# EAGLE design ToneGeneratorSMD_V2 (EAGLE 9.4.1)
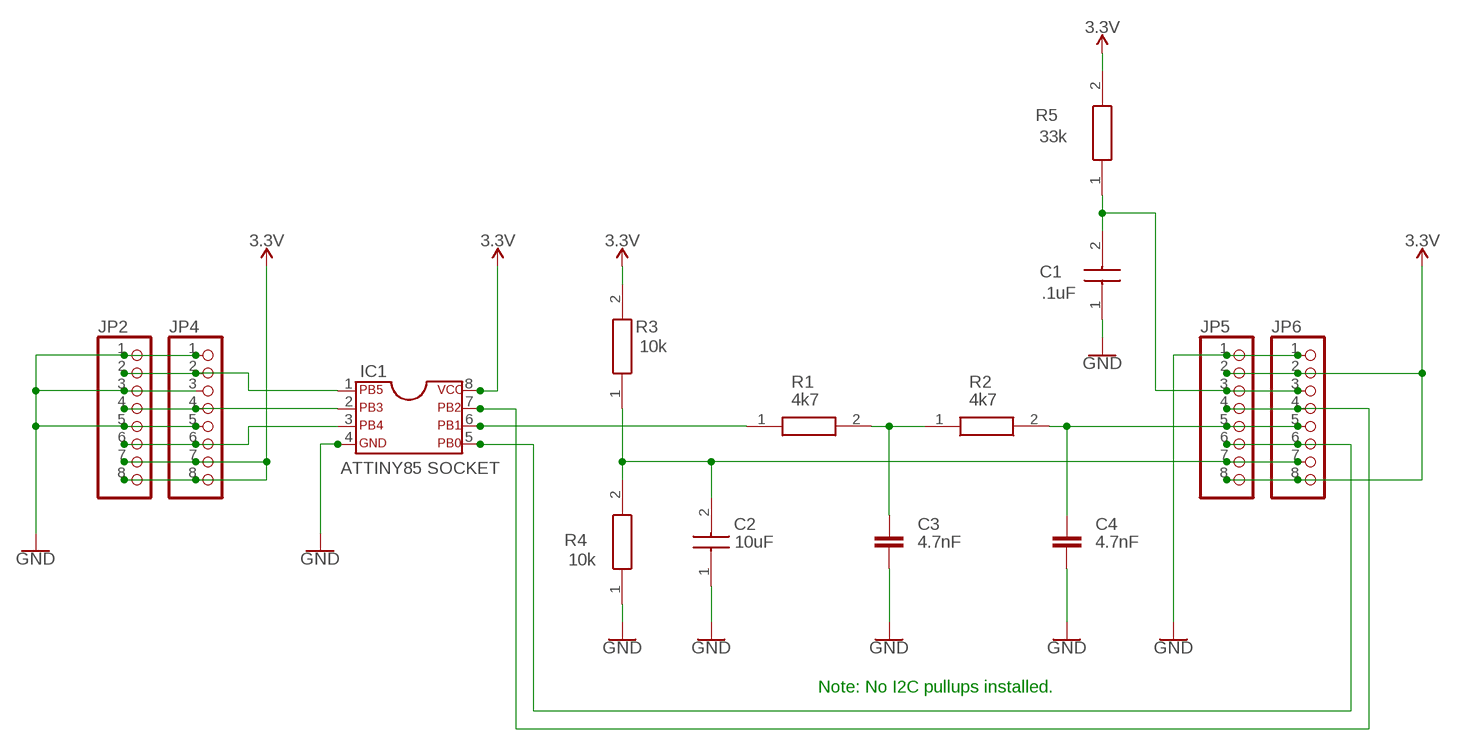
[diagram p0: schematic, sheet 1]

## Parts
C1  .1uF  885012207098  [CAPC2012X90N]
C2  10uF  GRM21BR61E106MA73L  [CAPC2012X145N]
C3  4.7nF  C-EUC0805  [C0805]
C4  4.7nF  C-EUC0805  [C0805]
IC1  ATTINY85 SOCKET  DIL8ATTINY85  [DIL08ATTINY85]
JP2  PINHD-1X8  [1X08]
JP4  PINHD-1X8  [1X08]
JP5  PINHD-1X8  [1X08]
JP6  PINHD-1X8  [1X08]
R1  4k7  ERJ-6GEYJ472V  [RESC2013X65N]
R2  4k7  ERJ-6GEYJ472V  [RESC2013X65N]
R3  10k  ERJ-6GEYJ472V  [RESC2013X65N]
R4  10k  ERJ-6GEYJ472V  [RESC2013X65N]
R5  33k  ERJ-6GEYJ472V  [RESC2013X65N]

## Nets
3.3V: IC1.8 JP2.7 JP2.8 JP4.7 JP4.8 JP5.2 JP5.8 JP6.2 JP6.8 R3.2(R2) R5.2(R2)
GND: C1.1 C2.1 C3.2 C4.2 IC1.4 JP2.1 JP2.3 JP2.5 JP4.1 JP4.3 JP4.5 JP5.1 JP6.1 R4.1(R1)
N$2: C3.1 R1.2(R2) R2.1(R1)
N$3: C4.1 JP5.5 JP6.5 R2.2(R2)
N$5: IC1.6 R1.1(R1)
N$8: IC1.7 JP5.4 JP6.4
N$12: IC1.1 JP2.2 JP4.2
N$14: IC1.2 JP2.4 JP4.4
N$16: IC1.3 JP2.6 JP4.6
N$21: C1.2 JP5.3 JP6.3 R5.1(R1)
N$24: IC1.5 JP5.6 JP6.6
N$25: C2.2 JP5.7 JP6.7 R3.1(R1) R4.2(R2)

## Notes on the sheet
- Note: No I2C pullups installed.

## Library data of the parts
C1 = ToneGenerator_Parts:885012207098: Multilayer Ceramic Capacitors MLCC - SMD/SMT WCAP-CSGP 0.1uF 0805 10% 50V MLCC Source: Datasheet <https://componentsearchengine.com/Datasheets/1/885012207098.pdf>; DESCRIPTION: Multilayer Ceramic Capacitors MLCC - SMD/SMT WCAP-CSGP 0.1uF 0805 10% 50V MLCC; HEIGHT: 0.9mm; MANUFACTURER_NAME: Wurth Elektronik; MANUFACTURER_PART_NUMBER: 885012207098; MOUSER_PART_NUMBER: 710-885012207098; MOUSER_PRICE-STOCK: https://www.mouser.com/Search/Refine.aspx?Keyword=710-885012207098
C2 = ToneGenerator_Parts:GRM21BR61E106MA73L: Multilayer Ceramic Capacitors MLCC - SMD/SMT 0805 10uF 25volts X5R 20% Source: Datasheet <https://componentsearchengine.com/Datasheets/1/GRM21BR61E106MA73L.pdf>; DESCRIPTION: Multilayer Ceramic Capacitors MLCC - SMD/SMT 0805 10uF 25volts X5R 20%; HEIGHT: 1.45mm; MANUFACTURER_NAME: Murata Electronics; MANUFACTURER_PART_NUMBER: GRM21BR61E106MA73L; MOUSER_PART_NUMBER: 81-GRM21BR61E106MA3L; MOUSER_PRICE-STOCK: https://www.mouser.com/Search/Refine.aspx?Keyword=81-GRM21BR61E106MA3L
C3 C4 = rcl:C-EU: CAPACITOR, European symbol; SPICEPREFIX: C
IC1 = ic-package_JGE:DIL8ATTINY85: Dual In Line / Socket
JP2 JP4-JP6 = pinhead:PINHD-1X8: PIN HEADER
R1-R5 = SamacSys_Parts:ERJ-6GEYJ472V: RESISTOR, 0805 4.7K Ohm +/-5% 0.125 W Source: Datasheet <https://componentsearchengine.com/Datasheets/1/ERJ-6GEYJ472V.pdf>; DESCRIPTION: RESISTOR, 0805 4.7K Ohm +/-5% 0.125 W; HEIGHT: mm; MANUFACTURER_NAME: Panasonic; MANUFACTURER_PART_NUMBER: ERJ-6GEYJ472V; MOUSER_PART_NUMBER: 667-ERJ-6GEYJ472V; MOUSER_PRICE-STOCK: https://www.mouser.com/Search/Refine.aspx?Keyword=667-ERJ-6GEYJ472V

## Board
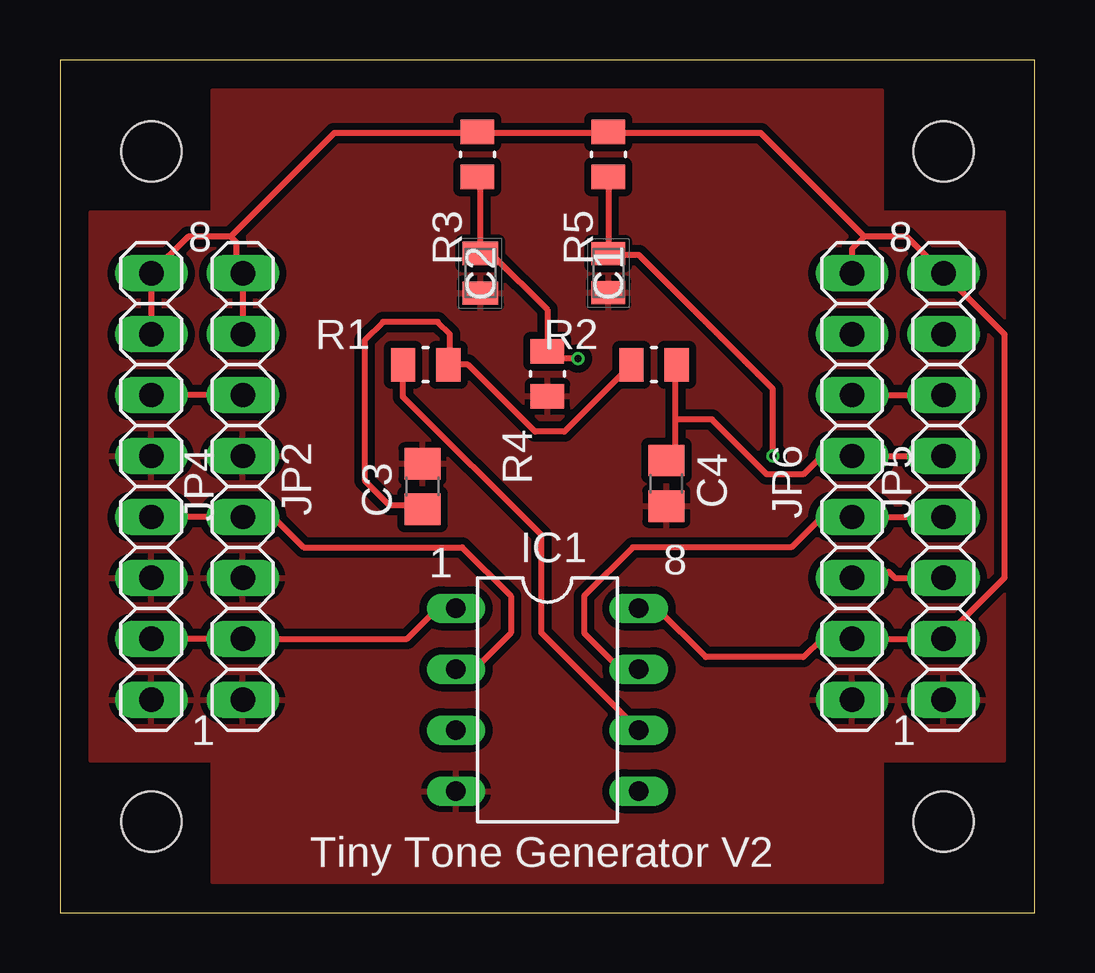
[diagram p1: board, top side]
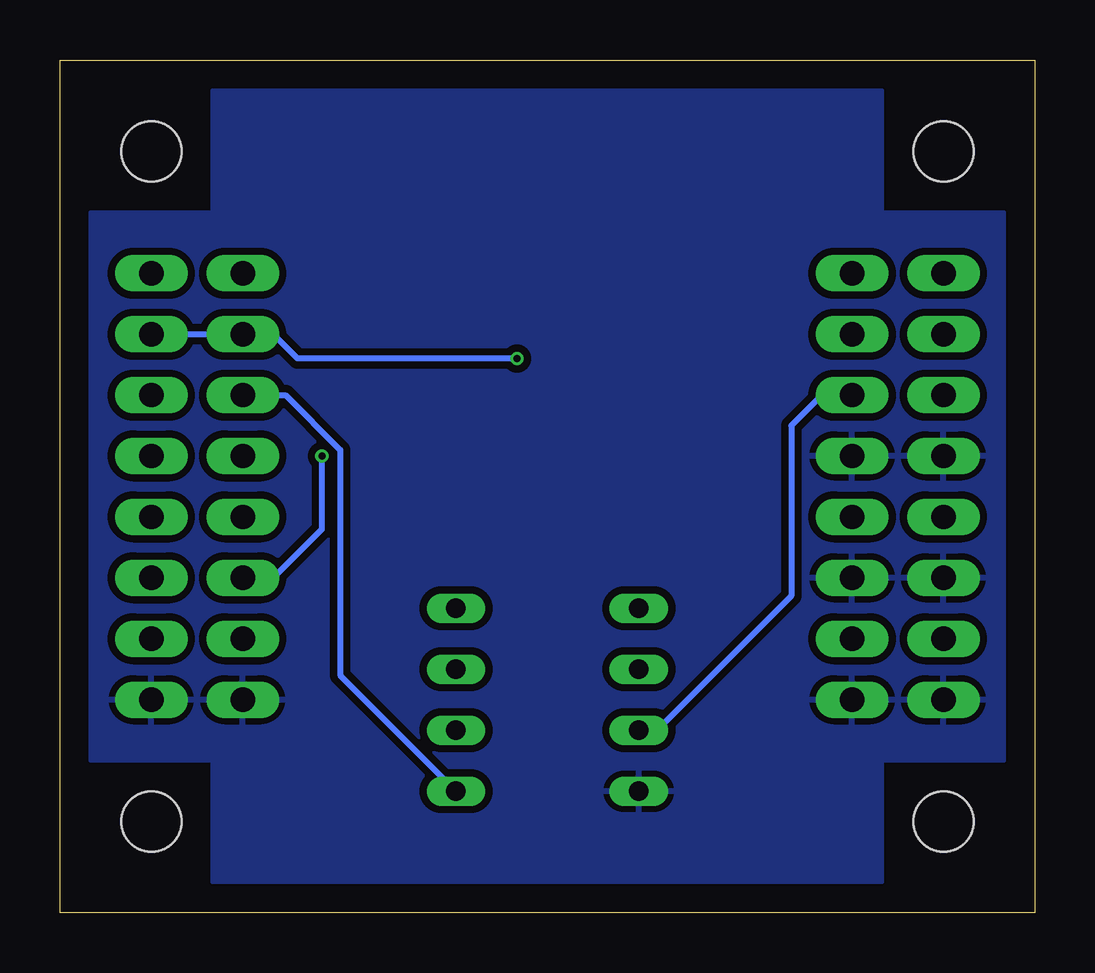
[diagram p2: board, bottom side, seen from below]

Size 40.64 x 35.56 mm. Coordinates in mm from the lower left corner, seen from the top.
Outline: 0,0 40.64,0 40.64,35.56 0,35.56 0,0
Copper layers (1*2*15*16): Top 0.035559375mm / dielectric 0.47751875mm / Route2 0.035559375mm / dielectric 0.47751875mm / Route15 0.035559375mm / dielectric 0.47751875mm / Bottom 0.035559375mm
Design rules "default JGE Seeed V6 10mm Trace": minimum track width 10mil, minimum drill 0.3mm, track to track 10mil, track to pad 10mil, pad to pad 10mil, via to via 10mil, smd to smd 6mil, copper to edge 1mm, drill to drill 4mil, minimum pad ring 5mil, minimum via ring 5mil, stop-mask expansion 4mil, vias tented up to drill 25mil, thermal gap 10mil
Holes 2.5 mm at 3.81,31.75 36.83,31.75 3.81,3.81 36.83,3.81

### Footprints (pad centres in the part's own frame; a part is rotated, then mirrored left to right if it is on the bottom)
CAPC2012X90N = smd 0.96 x 1.39: 1 -0.81,0; 2 0.81,0
CAPC2012X145N = smd 0.97 x 1.47: 1 -0.83,0; 2 0.83,0
C0805 = smd 1.3 x 1.5: 1 -0.95,0; 2 0.95,0
DIL08ATTINY85 = drill 0.813 long: 1 -3.81,-3.81; 2 -1.27,-3.81; 3 1.27,-3.81; 4 3.81,-3.81; 5 3.81,3.81; 6 1.27,3.81; 7 -1.27,3.81; 8 -3.81,3.81
1X08 = drill 1.016 long: 1 -8.89,0; 2 -6.35,0; 3 -3.81,0; 4 -1.27,0; 5 1.27,0; 6 3.81,0; 7 6.35,0; 8 8.89,0
RESC2013X65N = smd 1.016 x 1.397: 1 -0.94,0; 2 0.94,0

### Placement (x,y rotation side)
C1  22.86,26.67 90 top
C2  17.53,26.67 90 top
C3  15.11,17.78 90 top
C4  25.27,17.91 270 top
IC1  20.32,8.89 270 top
JP2  7.62,17.78 90 top
JP4  3.81,17.78 90 top
JP5  36.83,17.78 90 top
JP6  33.02,17.78 90 top
R1  15.24,22.86 0 top
R2  24.77,22.86 0 top
R3  17.4,31.62 90 top
R4  20.32,22.48 90 top
R5  22.86,31.62 90 top

### Tracks (layer width: path | path; a pad name or v marks a point on that pad's centre or on a via)
3.3V
  Top 0.254: IC1.8 24.89,12.7 26.92,10.67 30.99,10.67 31.75,11.43 JP6.2 JP5.2 39.37,13.97 39.37,24.13 JP5.8 35.31,28.19 33.53,28.19 | JP4.7 JP4.8 5.33,28.19 7.11,28.19 | JP2.7 JP2.8 7.37,26.92 7.37,27.94 7.11,28.19 | 22.86,32.51 17.53,32.51 R3.2 17.27,32.51 11.43,32.51 7.11,28.19 | JP6.8 33.02,27.69 33.53,28.19 | 22.86,32.51 29.21,32.51 33.53,28.19 | 22.86,32.51 R5.2
GND
  pour Top (isolate 0.305): 1.27,6.35 6.35,6.35 6.35,1.27 34.29,1.27 34.29,6.35 39.37,6.35 39.37,29.21 34.29,29.21 34.29,34.29 6.35,34.29 6.35,29.21 1.27,29.21
  pour Bottom (isolate 0.305): 1.27,29.21 6.35,29.21 6.35,34.29 34.29,34.29 34.29,29.21 39.37,29.21 39.37,6.35 34.29,6.35 34.29,1.27 6.35,1.27 6.35,6.35 1.27,6.35
N$2
  Top 0.254: 16.26,22.86 17.02,22.86 19.81,20.07 21.03,20.07 R2.1 | 16.26,22.86 16.26,24.13 15.75,24.64 13.46,24.64 12.7,23.88 12.7,18.03 13.72,17.02 14.99,17.02 C3.1 | 16.26,22.86 R1.2
N$3
  Top 0.254: 25.65,20.57 25.65,19.3 25.4,19.05 C4.1 | 25.65,20.57 25.65,22.86 R2.2 | 25.65,20.57 27.18,20.57 29.46,18.29 30.99,18.29 31.75,19.05 JP6.5 JP5.5
N$5
  Top 0.254: IC1.6 20.07,11.68 20.07,15.75 14.3,21.51 R1.1
N$8
  Top 0.254: IC1.7 23.37,10.16 21.84,11.68 21.84,13.21 23.88,15.24 30.48,15.24 31.75,16.51 JP6.4 JP5.4
N$12
  Top 0.254: IC1.1 15.75,12.7 14.48,11.43 JP2.2 JP4.2
N$14
  Top 0.254: IC1.2 17.27,10.16 18.8,11.68 18.8,13.21 16.76,15.24 10.16,15.24 8.89,16.51 JP2.4 JP4.4
N$16
  Top 0.254: JP2.6 JP4.6
  Bottom 0.254: IC1.3 15.75,7.62 10.16,13.21 10.16,20.32 8.89,21.59 JP2.6
N$21  (via drill 0.3)
  Top 0.254: R5.1 C1.2 22.86,27.43 24.13,27.43 29.72,21.84 v29.72,19.05 | JP5.3 34.8,13.97 34.54,14.22 33.27,14.22 JP6.3
  Bottom 0.254: v29.72,19.05 29.72,16 31.75,13.97 JP6.3
N$24
  Top 0.254: JP6.6 JP5.6
  Bottom 0.254: IC1.5 28.96,9.91 28.96,19.3 31.24,21.59 JP6.6
N$25  (via drill 0.3)
  Top 0.254: 18.03,27.43 17.53,27.43 C2.2 18.03,27.43 | 18.03,27.43 17.53,27.94 17.53,30.48 R3.1 | 18.03,27.43 20.32,25.15 20.32,23.62 R4.2 20.62,23.11 v21.59,23.11
  Bottom 0.254: v21.59,23.11 30.73,23.11 31.75,24.13 JP6.7 JP5.7

### Text on the board
tNames: 8 | 8 | 1 | 8 | 1 | 1 | Tiny Tone Generator V2